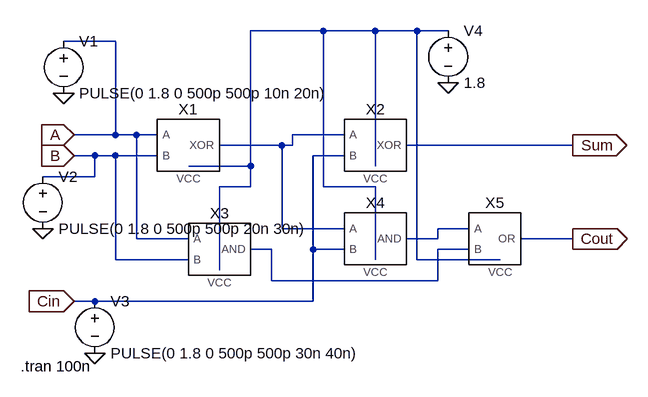
[diagram p0: schematic Full Adder.asc]
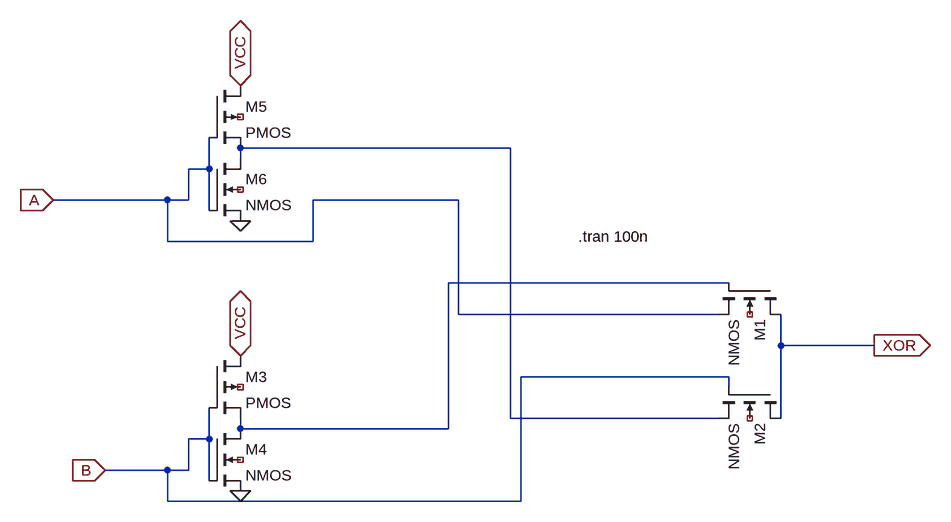
[diagram p1: sub-circuit xorpass.asc]
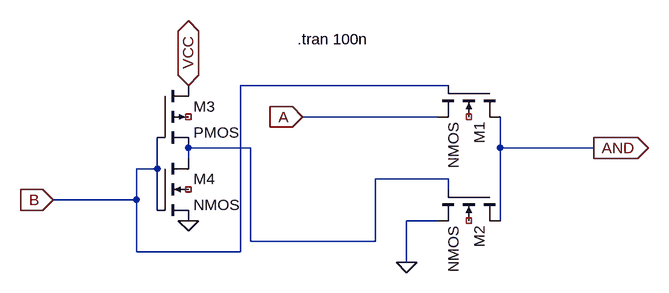
[diagram p2: sub-circuit andpass.asc]
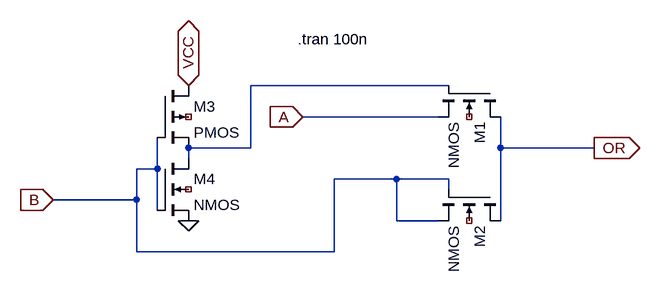
[diagram p3: sub-circuit orpass.asc]
Full Adder.asc, the LTspice schematic file:
Version 4
SHEET 1 880 680
WIRE 304 -80 192 -80
WIRE 384 -80 304 -80
WIRE 448 -80 384 -80
WIRE 496 -80 448 -80
WIRE -16 -64 -96 -64
WIRE -16 80 -16 -64
WIRE -16 80 -80 80
WIRE 16 80 -16 80
WIRE 48 80 16 80
WIRE 336 80 256 80
WIRE 240 96 144 96
WIRE 256 96 256 80
WIRE 256 96 240 96
WIRE 688 96 432 96
WIRE -48 112 -80 112
WIRE -16 112 -48 112
WIRE 48 112 -16 112
WIRE 336 112 288 112
WIRE 192 128 192 -80
WIRE 192 128 96 128
WIRE 384 128 384 -80
WIRE -48 144 -48 112
WIRE -48 144 -128 144
WIRE 192 160 192 128
WIRE 192 160 144 160
WIRE 304 160 304 -80
WIRE 384 160 304 160
WIRE 240 224 240 96
WIRE 336 224 240 224
WIRE 528 224 480 224
WIRE 16 240 16 80
WIRE 96 240 16 240
WIRE 480 240 480 224
WIRE 480 240 432 240
WIRE 688 240 608 240
WIRE 224 256 192 256
WIRE 288 256 288 112
WIRE 336 256 288 256
WIRE 528 256 480 256
WIRE -16 272 -16 112
WIRE 96 272 -16 272
WIRE 384 272 384 160
WIRE 448 272 448 -80
WIRE 576 272 448 272
WIRE 144 288 144 160
WIRE 224 304 224 256
WIRE 480 304 480 256
WIRE 480 304 224 304
WIRE -48 336 -80 336
WIRE 288 336 288 256
WIRE 288 336 -48 336
FLAG -96 16 0
FLAG -128 224 0
FLAG -48 416 0
FLAG -80 80 A
IOPIN -80 80 In
FLAG -80 112 B
IOPIN -80 112 In
FLAG -80 336 Cin
IOPIN -80 336 In
FLAG 688 96 Sum
IOPIN 688 96 Out
FLAG 688 240 Cout
IOPIN 688 240 Out
FLAG 496 0 0
SYMBOL XORpass 96 96 R0
SYMATTR InstName X1
SYMBOL XORpass 384 96 R0
SYMATTR InstName X2
SYMBOL ANDpass 144 256 R0
SYMATTR InstName X3
SYMBOL ANDpass 384 240 R0
SYMATTR InstName X4
SYMBOL voltage -96 -80 R0
WINDOW 123 0 0 Left 0
WINDOW 39 0 0 Left 0
SYMATTR InstName V1
SYMATTR Value PULSE(0 1.8 0 500p 500p 10n 20n)
SYMBOL voltage -128 128 R0
WINDOW 123 0 0 Left 0
WINDOW 39 0 0 Left 0
SYMATTR InstName V2
SYMATTR Value PULSE(0 1.8 0 500p 500p 20n 30n)
SYMBOL voltage -48 320 R0
WINDOW 123 0 0 Left 0
WINDOW 39 0 0 Left 0
SYMATTR InstName V3
SYMATTR Value PULSE(0 1.8 0 500p 500p 30n 40n)
SYMBOL ORpass 560 240 R0
SYMATTR InstName X5
SYMBOL voltage 496 -96 R0
WINDOW 123 0 0 Left 0
WINDOW 39 0 0 Left 0
SYMATTR InstName V4
SYMATTR Value 1.8
TEXT -162 436 Left 2 !.tran 100n

xorpass.asc, the sub-circuit schematic file:
Version 4
SHEET 1 880 680
WIRE 144 -160 -272 -160
WIRE -272 -144 -272 -160
WIRE -320 -128 -320 -176
WIRE -320 -128 -352 -128
WIRE -384 -80 -560 -80
WIRE -352 -80 -352 -128
WIRE -352 -80 -384 -80
WIRE 64 -80 -160 -80
WIRE -320 -64 -320 -128
WIRE -384 -16 -384 -80
WIRE -160 -16 -160 -80
WIRE -160 -16 -384 -16
WIRE 480 48 48 48
WIRE 64 96 64 -80
WIRE 464 96 64 96
WIRE 560 144 560 96
WIRE 704 144 560 144
WIRE 480 192 160 192
WIRE 480 208 480 192
WIRE 144 256 144 -160
WIRE 464 256 144 256
WIRE 560 256 560 144
WIRE -272 272 -272 256
WIRE 48 272 48 48
WIRE 48 272 -272 272
WIRE -320 288 -320 240
WIRE -320 288 -352 288
WIRE -384 336 -480 336
WIRE -352 336 -352 288
WIRE -352 336 -384 336
WIRE -320 352 -320 288
WIRE -384 384 -384 336
WIRE 160 384 160 192
WIRE 160 384 -384 384
FLAG 704 144 XOR
IOPIN 704 144 Out
FLAG -560 -80 A
IOPIN -560 -80 In
FLAG -480 336 B
IOPIN -480 336 In
FLAG -272 368 0
FLAG -272 -48 0
FLAG -272 -256 VCC
IOPIN -272 -256 BiDir
FLAG -272 160 VCC
IOPIN -272 160 BiDir
SYMBOL nmos4 560 48 R90
SYMATTR InstName M1
SYMBOL nmos4 560 208 R90
SYMATTR InstName M2
SYMBOL pmos4 -320 160 R0
SYMATTR InstName M3
SYMBOL nmos4 -320 272 R0
SYMATTR InstName M4
SYMBOL pmos4 -320 -256 R0
SYMATTR InstName M5
SYMBOL nmos4 -320 -144 R0
SYMATTR InstName M6
TEXT 248 -24 Left 2 !.tran 100n

andpass.asc, the sub-circuit schematic file:
Version 4
SHEET 1 880 680
WIRE 480 48 160 48
WIRE 464 96 256 96
WIRE 176 144 80 144
WIRE 560 144 560 96
WIRE 704 144 560 144
WIRE 80 160 80 144
WIRE 32 176 32 128
WIRE 32 176 0 176
WIRE 480 192 368 192
WIRE 480 208 480 192
WIRE 0 224 0 176
WIRE 0 224 -128 224
WIRE 32 240 32 176
WIRE 464 256 416 256
WIRE 560 256 560 144
WIRE 176 288 176 144
WIRE 368 288 368 192
WIRE 368 288 176 288
WIRE 0 304 0 224
WIRE 160 304 160 48
WIRE 160 304 0 304
WIRE 416 320 416 256
FLAG 416 320 0
FLAG 704 144 AND
IOPIN 704 144 Out
FLAG 256 96 A
IOPIN 256 96 In
FLAG -128 224 B
IOPIN -128 224 In
FLAG 80 256 0
FLAG 80 48 VCC
IOPIN 80 48 BiDir
SYMBOL nmos4 560 48 R90
SYMATTR InstName M1
SYMBOL nmos4 560 208 R90
SYMATTR InstName M2
SYMBOL pmos4 32 48 R0
SYMATTR InstName M3
SYMBOL nmos4 32 160 R0
SYMATTR InstName M4
TEXT 248 -24 Left 2 !.tran 100n

orpass.asc, the sub-circuit schematic file:
Version 4
SHEET 1 880 680
WIRE 480 48 176 48
WIRE 464 96 256 96
WIRE 176 144 176 48
WIRE 176 144 80 144
WIRE 560 144 560 96
WIRE 704 144 560 144
WIRE 80 160 80 144
WIRE 32 176 32 128
WIRE 32 176 0 176
WIRE 400 192 304 192
WIRE 480 192 400 192
WIRE 480 208 480 192
WIRE 0 224 0 176
WIRE 0 224 -128 224
WIRE 32 240 32 176
WIRE 400 256 400 192
WIRE 464 256 400 256
WIRE 560 256 560 144
WIRE 0 304 0 224
WIRE 304 304 304 192
WIRE 304 304 0 304
FLAG 704 144 OR
IOPIN 704 144 Out
FLAG 256 96 A
IOPIN 256 96 In
FLAG -128 224 B
IOPIN -128 224 In
FLAG 80 256 0
FLAG 80 48 VCC
IOPIN 80 48 BiDir
SYMBOL nmos4 560 48 R90
SYMATTR InstName M1
SYMBOL nmos4 560 208 R90
SYMATTR InstName M2
SYMBOL pmos4 32 48 R0
SYMATTR InstName M3
SYMBOL nmos4 32 160 R0
SYMATTR InstName M4
TEXT 248 -24 Left 2 !.tran 100n

The netlist it stands for:
* Full Adder.asc
XX1 A B N002 N001 xorpass
XX2 N002 Cin Sum N001 xorpass
XX3 A B N004 N001 andpass
XX4 N002 Cin N003 N001 andpass
V1 A 0 PULSE(0 1.8 0 500p 500p 10n 20n)
V2 B 0 PULSE(0 1.8 0 500p 500p 20n 30n)
V3 Cin 0 PULSE(0 1.8 0 500p 500p 30n 40n)
XX5 N003 N004 Cout N001 orpass
V4 N001 0 1.8

* block symbol definitions
.subckt xorpass A B XOR VCC
M1 XOR N002 A NC_01 NMOS
M2 XOR B N001 NC_02 NMOS
M3 VCC B N002 NC_03 PMOS
M4 N002 B 0 NC_04 NMOS
M5 VCC A N001 NC_05 PMOS
M6 N001 A 0 NC_06 NMOS
.tran 100n
.ends xorpass

.subckt andpass A B AND VCC
M1 AND B A NC_01 NMOS
M2 AND N001 0 NC_02 NMOS
M3 VCC B N001 NC_03 PMOS
M4 N001 B 0 NC_04 NMOS
.tran 100n
.ends andpass

.subckt orpass A B OR VCC
M1 OR N001 A NC_01 NMOS
M2 OR B B NC_02 NMOS
M3 VCC B N001 NC_03 PMOS
M4 N001 B 0 NC_04 NMOS
.tran 100n
.ends orpass

.model NMOS NMOS
.model PMOS PMOS
.lib standard.mos
.tran 100n
.backanno
.end